# EAGLE design linearIntegrated (EAGLE 8.4.0)
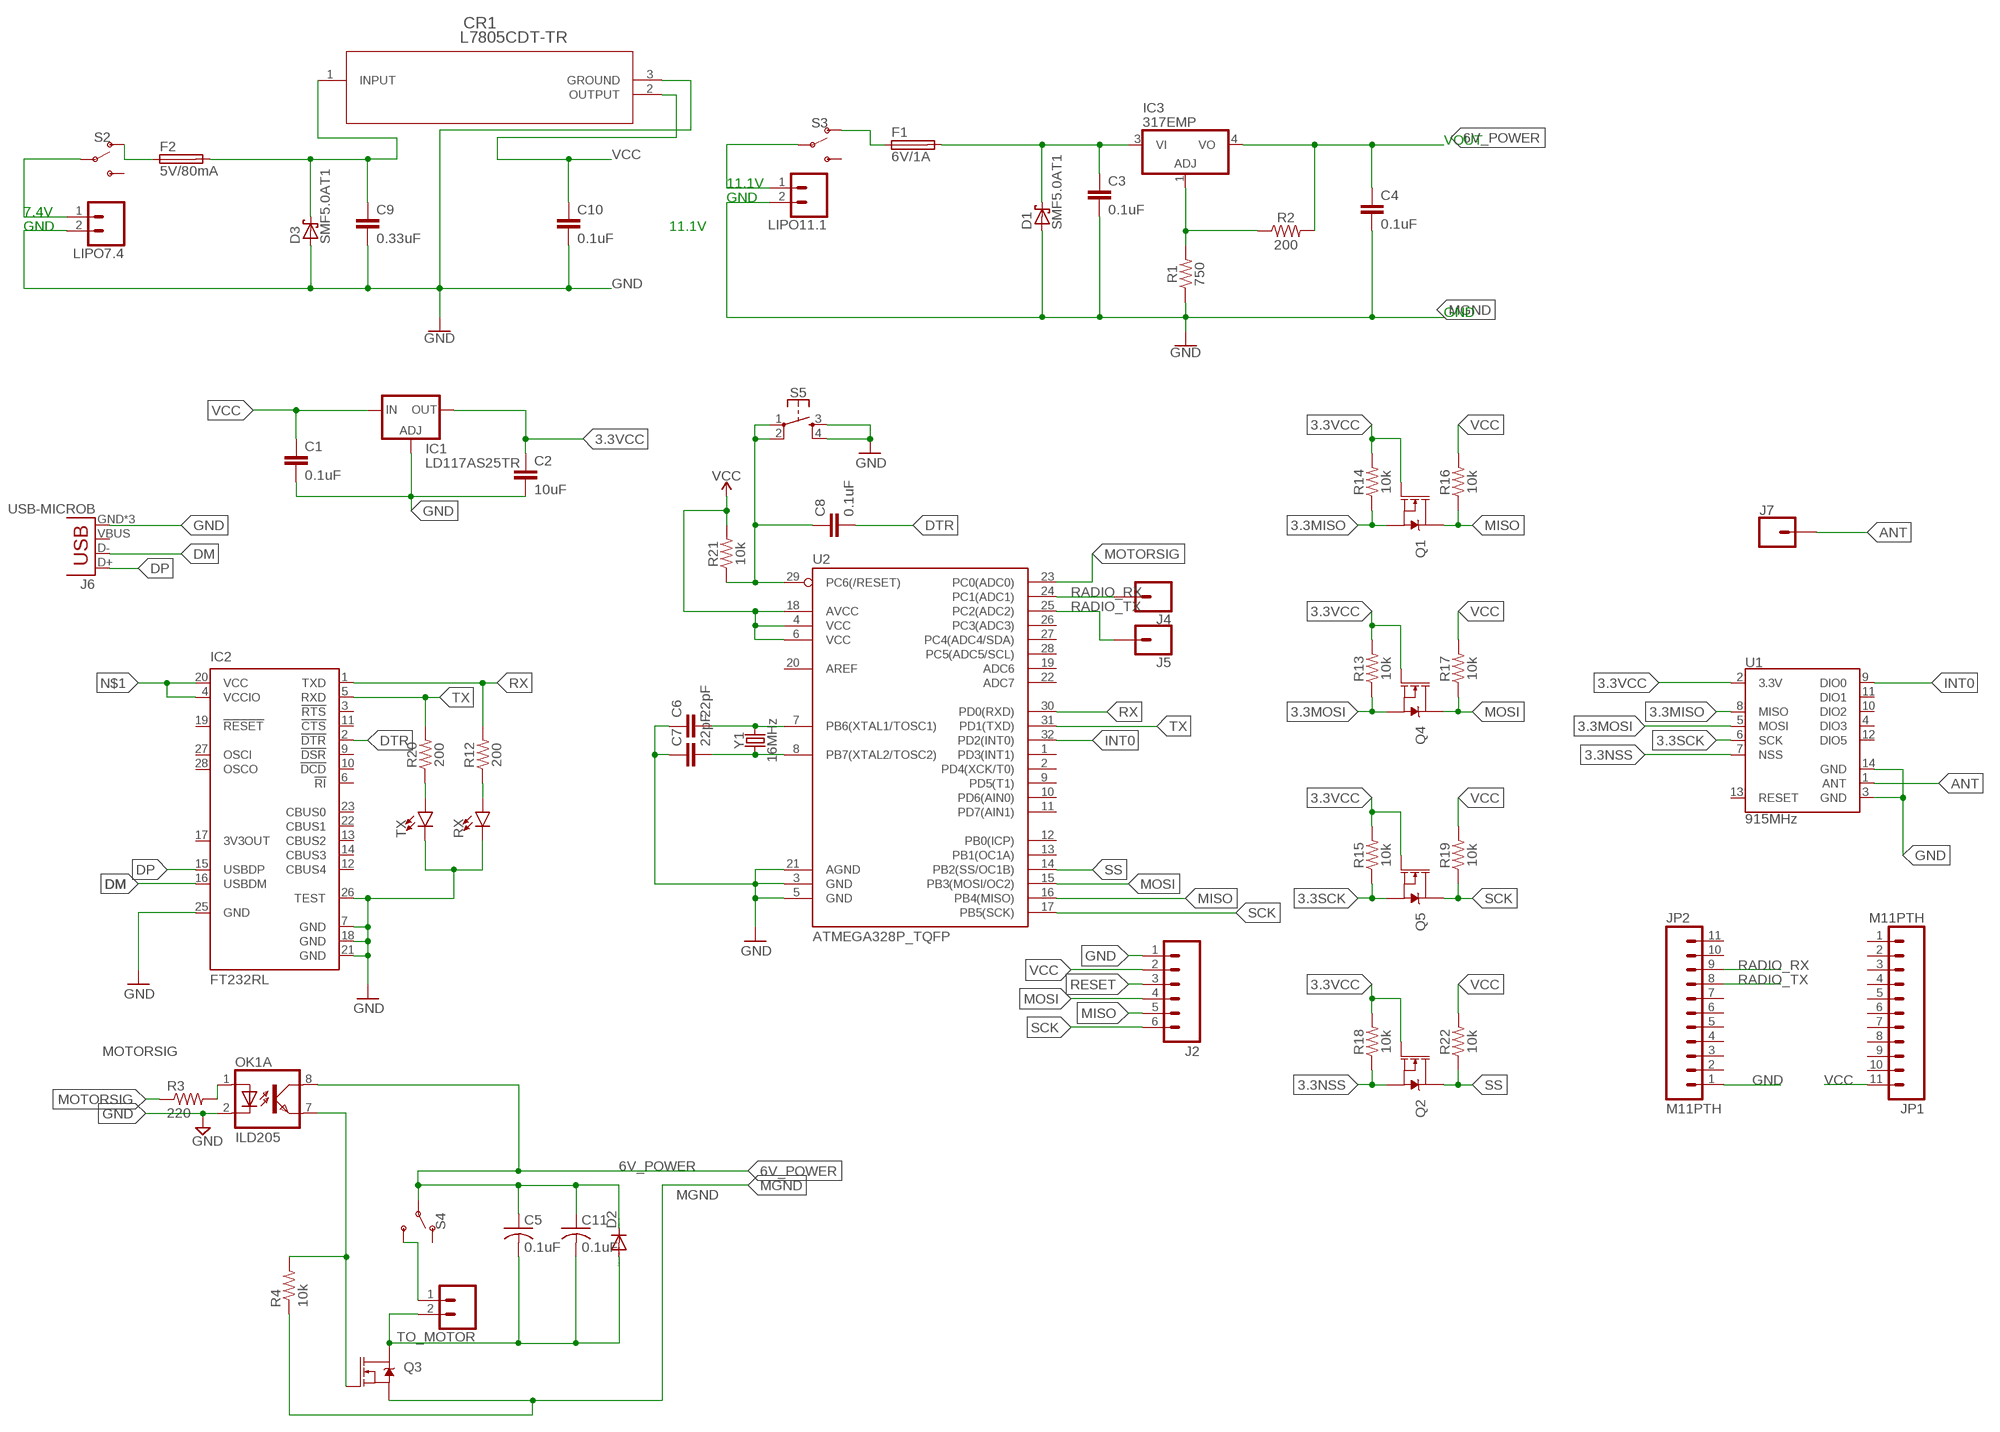
[diagram p0: schematic, sheet 1]

## Parts
C1  0.1uF  10UF-1206-6.3V-20%  [1206]
C2  10uF  10UF-1206-6.3V-20%  [1206]
C3  0.1uF  4.7UF-1206-16V-(+80/-20%)  [1206]
C4  0.1uF  4.7UF-1206-16V-(+80/-20%)  [1206]
C5  0.1uF  C-USC1206  [C1206]
C6  22pF  10UF-1206-6.3V-20%  [1206]
C7  22pF  10UF-1206-6.3V-20%  [1206]
C8  0.1uF  10UF-1206-6.3V-20%  [1206]
C9  0.33uF  4.7UF-1206-16V-(+80/-20%)  [1206]
C10  0.1uF  4.7UF-1206-16V-(+80/-20%)  [1206]
C11  0.1uF  C-USC1206  [C1206]
CR1  L7805CDT-TR  [DPAK]
D1  SMF5.0AT1  [SOD123FL]
D2  DIODE-DO-214AC  [DO-214AC]
D3  SMF5.0AT1  [SOD123FL]
F1  6V/1A  FUSEPICOFUSE  [PICOFUSE]
F2  5V/80mA  FUSEPICOFUSE  [PICOFUSE]
IC1  LD117AS25TR  [SOT223]
IC2  FT232RL  [SSOP28]
IC3  317EMP  [SOT223]
J2  M06FEMALE_LOCK  [1X06_FEMALE_LOCK.010]
J4  CONN_01  [1X01]
J5  CONN_01  [1X01]
J6  USB-MICROB  [USB-MICROB]
J7  CONN_01  [1X01]
JP1  M11PTH  [1X11]
JP2  M11PTH  [1X11]
LIPO7.4  CONN_02  [1X02]
LIPO11.1  CONN_02  [1X02]
OK1  ILD205  [SOIC08]
Q1  220mA/50V/3.5Ω  MOSFET-NCH-BSS138  [SOT23-3]
Q2  220mA/50V/3.5Ω  MOSFET-NCH-BSS138  [SOT23-3]
Q3  MOSFET-NCH-BSS138  [SOT23-3]
Q4  220mA/50V/3.5Ω  MOSFET-NCH-BSS138  [SOT23-3]
Q5  220mA/50V/3.5Ω  MOSFET-NCH-BSS138  [SOT23-3]
R1  750  10OHM-1206-1/4W-1%  [1206]
R2  200  10OHM-1206-1/4W-1%  [1206]
R3  220  RESISTOR1206  [1206]
R4  10k  RESISTOR1206  [1206]
R12  200  RESISTOR1206  [1206]
R13  10k  RESISTOR1206  [1206]
R14  10k  RESISTOR1206  [1206]
R15  10k  RESISTOR1206  [1206]
R16  10k  RESISTOR1206  [1206]
R17  10k  RESISTOR1206  [1206]
R18  10k  RESISTOR1206  [1206]
R19  10k  RESISTOR1206  [1206]
R20  200  RESISTOR1206  [1206]
R21  10k  RESISTOR1206  [1206]
R22  10k  RESISTOR1206  [1206]
RX  LED1206  [LED-1206]
S2  SWITCH-SPDT-PTH-11.6X4.0MM  [SWITCH_SPDT_PTH_11.6X4.0MM]
S3  SWITCH-SPDT-PTH-11.6X4.0MM  [SWITCH_SPDT_PTH_11.6X4.0MM]
S4  SWITCH-SPDT-PTH-11.6X4.0MM  [SWITCH_SPDT_PTH_11.6X4.0MM]
S5  MOMENTARY-SWITCH-SPST-2-SMD-5.2MM  [TACTILE_SWITCH_SMD_5.2MM]
TO_MOTOR  CONN_02  [1X02]
TX  LED1206  [LED-1206]
U1  915MHz  RFM69CW-915MHZ  [RFM69CW-XXXS2]
U2  ATMEGA328P_TQFP  [TQFP32-08]
Y1  16MHz  CRYSTAL-16MHZPTH-HC49US  [HC49US]

## Nets
3.3MISO: Q1.2(S) R14.1 U1.8(MISO)
3.3MOSI: Q4.2(S) R13.1 U1.5(MOSI)
3.3NSS: Q2.2(S) R18.1 U1.7(NSS)
3.3SCK: Q5.2(S) R15.1 U1.6(SCK)
3.3VCC: C2.1 IC1.4(OUT) Q1.1(G) Q2.1(G) Q4.1(G) Q5.1(G) R13.2 R14.2 R15.2 R18.2 U1.2(3.3V)
6V_POWER [motor]: C4.1 C5.1 C11.1 D2.C IC3.4(VO) OK1.8(A:COL) R2.2 S4.2(P)
ANT: J7.1 U1.1(ANT)
DM: IC2.16(USBDM) J6.D-
DP: IC2.15(USBDP) J6.D+
DRAIN [motor]: C5.2 C11.2 D2.A Q3.3(D) TO_MOTOR.2
DTR: C8.2 IC2.2(!DTR)
GATE: OK1.7(A:EMIT) Q3.1(G) R4.2
GND: C1.2 C2.2 C6.1 C7.1 C9.2 C10.2 CR1.3(GROUND) D3.A IC1.1(ADJ) IC2.7(GND) IC2.18(GND) IC2.21(GND) IC2.25(GND) IC2.26(TEST) J2.1 J6.GND J6.MT1(GND) J6.MT2(GND) JP2.1 LIPO7.4.2 OK1.2(A:C) RX.C S5.3 S5.4 TX.C U1.3(GND) U1.14(GND) U2.3(GND) U2.5(GND) U2.21(AGND)
INT0: U1.9(DIO0) U2.32(PD2(INT0))
MGND [motor]: C3.2 C4.2 D1.A LIPO11.1.2 Q3.2(S) R1.1 R4.1 ; supply symbol labelled GND
MISO: J2.5 Q1.3(D) R16.1 U2.16(PB4(MISO))
MOSI: J2.4 Q4.3(D) R17.1 U2.15(PB3(MOSI/OC2))
MOTORSIG: R3.1 U2.23(PC0(ADC0))
N$1: IC2.4(VCCIO) IC2.20(VCC)
N$4: C6.2 U2.7(PB6(XTAL1/TOSC1)) Y1.2
N$5: C7.2 U2.8(PB7(XTAL2/TOSC2)) Y1.1
N$6 [motor]: F1.1 S3.1(O)
N$7: R20.1 TX.A
N$8: R12.1 RX.A
N$9 [motor]: C3.1 D1.C F1.2 IC3.3(VI)
N$10 [motor]: IC3.1(ADJ) R1.2 R2.1
N$11 [motor]: LIPO11.1.1 S3.2(P)
N$12: OK1.1(A:A) R3.2
N$13 [motor]: S4.3(S) TO_MOTOR.1
N$19: LIPO7.4.1 S2.2(P)
N$20: F2.1 S2.1(O)
N$21: C9.1 CR1.1(INPUT) D3.C F2.2
RADIO_RX: J4.1 JP2.9 U2.24(PC1(ADC1))
RADIO_TX: J5.1 JP2.8 U2.25(PC2(ADC2))
RESET: C8.1 J2.3 R21.1 S5.1 S5.2 U2.29(PC6(/RESET))
RX: IC2.1(TXD) R12.2 U2.30(PD0(RXD))
SCK: J2.6 Q5.3(D) R19.1 U2.17(PB5(SCK))
SS: Q2.3(D) R22.1 U2.14(PB2(SS/OC1B))
TX: IC2.5(RXD) R20.2 U2.31(PD1(TXD))
VCC: C1.1 C10.1 CR1.2(OUTPUT) IC1.3(IN) J2.2 JP1.11 R16.2 R17.2 R19.2 R21.2 R22.2 U2.4(VCC) U2.6(VCC) U2.18(AVCC)
Unconnected: IC2.3(!RTS) IC2.6(!RI) IC2.9(!DSR) IC2.10(!DCD) IC2.11(!CTS) IC2.12(CBUS4) IC2.13(CBUS2) IC2.14(CBUS3) IC2.17(3V3OUT) IC2.19(!RESET) IC2.22(CBUS1) IC2.23(CBUS0) IC2.27(OSCI) IC2.28(OSCO) J6.VBUS JP1.1 JP1.2 JP1.3 JP1.4 JP1.5 JP1.6 JP1.7 JP1.8 JP1.9 JP1.10 JP2.2 JP2.3 JP2.4 JP2.5 JP2.6 JP2.7 JP2.10 JP2.11 OK1.3(B:A) OK1.4(B:C) OK1.5(B:EMIT) OK1.6(B:COL) S2.3(S) S3.3(S) S4.1(O) U1.4(DIO3) U1.10(DIO2) U1.11(DIO1) U1.12(DIO5) U1.13(RESET) U2.1(PD3(INT1)) U2.2(PD4(XCK/T0)) U2.9(PD5(T1)) U2.10(PD6(AIN0)) U2.11(PD7(AIN1)) U2.12(PB0(ICP)) U2.13(PB1(OC1A)) U2.19(ADC6) U2.20(AREF) U2.22(ADC7) U2.26(PC3(ADC3)) U2.27(PC4(ADC4/SDA)) U2.28(PC5(ADC5/SCL))

## Notes on the sheet
- VOUT
- 11.1V
- GND
- 7.4V
- GND | 11.1V
- GND

## Library data of the parts
C1 C6-C8 = SparkFun-Capacitors:10UF: 10.0µF ceramic capacitors A capacitor is a passive two-terminal electrical component used to store electrical energy temporarily in an electric field.; PROD_ID: CAP-10057; VALUE: 10uF
C2 = SparkFun-Capacitors:10UF: 10.0µF ceramic capacitors A capacitor is a passive two-terminal electrical component used to store electrical energy temporarily in an electric field.; PROD_ID: CAP-10057
C3 C4 C9 C10 = SparkFun-Capacitors:4.7UF: 4.7µF ceramic capacitors A capacitor is a passive two-terminal electrical component used to store electrical energy temporarily in an electric field.; PROD_ID: CAP-10300; VALUE: 4.7uF
C5 C11 = rcl:C-US: CAPACITOR, American symbol
CR1 = 7805:L7805CDT-TR; MANUFACTURER_PART_NUMBER: L7805CDTTR; VENDOR: ST Microelectronics
D1 D3 = diode:SMF5.0AT1: 200 W Transient Voltage Suppressor Source: Data sheet <http://www.onsemi.com/pub_link/Collateral/SMF5.0AT1-D.PDF>
D2 = diode:DIODE-: DIODE
F1 F2 = fuse:FUSE: Fuse; OC_FARNELL: unknown; OC_NEWARK: unknown
IC1 = v-reg:LD117A?*: Low drop fixed and adjustable positive voltage regulators 1 A Source: http://www.st.com/stonline/products/literature/ds/7194/ld1117axx.pdf
IC2 = ftdichip:FT232R: Source: http://www.ftdichip.com/Documents/DataSheets/DS_FT232R_v104.pdf; MPN: FT232RL; OC_FARNELL: 1146032; OC_NEWARK: 91K9918
IC3 = linear:*317: Positive VOLTAGE REGULATOR
J2 = SparkFun-Connectors:M06: Header 6 Standard 6-pin 0.1" header. Use with straight break away headers (SKU : PRT-00116), right angle break away headers (PRT-00553), swiss pins (PRT-00743), machine pins (PRT-00117), and female headers (PRT-00115). Molex polarized connector foot print use with SKU : PRT-08094 with associated crimp pins and housings. NOTES ON THE VARIANTS LOCK and LOCK_LONGPADS... This footprint was designed to help hold the alignment of a through-hole component (i.e. 6-pin header) while soldering it into place. You may notice that each hole has been shifted either up or down by 0.005 of an inch from it's more standard position (which is a perfectly straight line). This slight alteration caused the pins (the squares in the middle) to touch the edges of the holes. Because they are alternating, it causes a "brace" to hold the component in place. 0.005 has proven to be the perfect amount of "off-center" position when using our standard breakaway headers. Although looks a little odd when you look at the bare footprint, once you have a header in there, the alteration is very hard to notice. Also,if you push a header all the way into place, it is covered up entirely on the bottom side. This idea of altering the position of holes to aid alignment will be further integrated into the Sparkfun Library for other footprints. It can help hold any component with 3 or more connection pins.
J4 J5 J7 = SparkFun-Connectors:CONN_01: Single connection point. Often used as Generic Header-pin footprint for 0.1 inch spaced/style header connections On any of the 0.1 inch spaced packages, you can populate with these: Break Away Headers - Straight <https://www.sparkfun.com/products/116> (PRT-00116) Break Away Male Headers - Right Angle <https://www.sparkfun.com/products/553> (PRT-00553) Female Headers <https://www.sparkfun.com/products/115> (PRT-00115) Break Away Headers - Machine Pin <https://www.sparkfun.com/products/117> (PRT-00117) Break Away Female Headers - Swiss Machine Pin <https://www.sparkfun.com/products/743> (PRT-00743) This device is also useful as a general connection point to wire up your design to another part of your project. Our various solder wires solder well into these plated through hole pads. Hook-Up Wire - Assortment (Stranded, 22 AWG) <https://www.sparkfun.com/products/11375> (PRT-11375) Hook-Up Wire - Assortment (Solid Core, 22 AWG) <https://www.sparkfun.com/products/11367> (PRT-11367) View the entire wire category on our website here <https://www.sparkfun.com/categories/141> Special notes: SMTSO-256-ET is a "flush mount" nut for a 4-40 screw. We mostly use this on specialty testbeds; it is a nice way to connect hardware to your PCB at an adjustable hieght. Also note, the SNAP packages are for using a snappable style connector. We sell a baggie of snaps and they are also used on two LilyPad designs: Snap Assortment - 30 pack (male and female) <https://www.sparkfun.com/products/11347> (DEV-11347) LilyPad Arduino SimpleSnap <https://www.sparkfun.com/products/10941> (DEV-10941) LilyPad SimpleSnap Protoboard <https://www.sparkfun.com/products/10940> (DEV-10940)
J6 = SparkFun-Retired:USB: USB Connectors USB-B-PTH is fully proven SKU : PRT-00139/CONN-08278 USB-miniB is fully proven SKU : PRT-00587 USB-A-PCB is untested. USB-A-H is throughly reviewed, but untested. Spark Fun Electronics SKU : PRT-00437 USB-B-SMT is throughly reviewed, but untested. Needs silkscreen touching up. USB-A-S has not been used/tested USB-MB-H has not been used/tested USB-MICROB has been used. CONN-09505; PROD_ID: CONN-09505
JP1 JP2 = SparkFun:M11: Header 11 Standard 11-pin 0.1" header. Use with straight break away headers (SKU : PRT-00116), right angle break away headers (PRT-00553), swiss pins (PRT-00743), machine pins (PRT-00117), and female headers (PRT-00115).
LIPO7.4 LIPO11.1 TO_MOTOR = SparkFun-Connectors:CONN_02: Multi connection point. Often used as Generic Header-pin footprint for 0.1 inch spaced/style header connections On any of the 0.1 inch spaced packages, you can populate with these: Break Away Headers - Straight <https://www.sparkfun.com/products/116> (PRT-00116) Break Away Male Headers - Right Angle <https://www.sparkfun.com/products/553> (PRT-00553) Female Headers <https://www.sparkfun.com/products/115> (PRT-00115) Break Away Headers - Machine Pin <https://www.sparkfun.com/products/117> (PRT-00117) Break Away Female Headers - Swiss Machine Pin <https://www.sparkfun.com/products/743> (PRT-00743) For SCREWTERMINALS and SPRING TERMINALS visit here: Screw Terimnals on SparkFun.com <https://www.sparkfun.com/search/results?term=Screw+Terminals> (5mm/3.5mm/2.54mm spacing) This device is also useful as a general connection point to wire up your design to another part of your project. Our various solder wires solder well into these plated through hole pads. Hook-Up Wire - Assortment (Stranded, 22 AWG) <https://www.sparkfun.com/products/11375> (PRT-11375) Hook-Up Wire - Assortment (Solid Core, 22 AWG) <https://www.sparkfun.com/products/11367> (PRT-11367) View the entire wire category on our website here <https://www.sparkfun.com/categories/141> Special notes: Molex polarized connector foot print use with: PRT-08233 with associated crimp pins and housings. 2.54_SCREWTERM for use with PRT-10571. 3.5mm Screw Terminal footprints for PRT-08084 5mm Screw Terminal footprints for use with PRT-08432
OK1 = optocoupler:ILD2*: Siemens ILD205/206/207/211/213/217 DUAL PHOTOTRANSISTOR SMALL OUTLINE SURFACE MOUNT OPTOCOUPLER Source: 153385-da-01-en-Optocoupler_ILD205-T.pdf; MF: VISHAY/TELEFUNKEN; MPN: ILD205T; OC_FARNELL: 1469512; OC_NEWARK: 20H8678
Q1 Q2 Q4 Q5 = SparkFun-DiscreteSemi:MOSFET-NCH: N-channel MOSFETs Voltage controlled devices that allow control of high current outputs. SparkFun Products: SparkFun OpenScale <https://www.sparkfun.com/products/13261> SparkFun Digital Sandbox <https://www.sparkfun.com/products/12651> SparkFun Monster Moto Shield <https://www.sparkfun.com/products/10182> SparkFun MOSFET Power Controller <https://www.sparkfun.com/products/11214>; PROD_ID: TRANS-00830
Q3 = SparkFun-DiscreteSemi:MOSFET-NCH: N-channel MOSFETs Voltage controlled devices that allow control of high current outputs. SparkFun Products: SparkFun OpenScale <https://www.sparkfun.com/products/13261> SparkFun Digital Sandbox <https://www.sparkfun.com/products/12651> SparkFun Monster Moto Shield <https://www.sparkfun.com/products/10182> SparkFun MOSFET Power Controller <https://www.sparkfun.com/products/11214>; PROD_ID: TRANS-00830; VALUE: 220mA/50V/3.5Ω
R1 R2 = SparkFun-Resistors:10OHM: 10Ω resistor A resistor is a passive two-terminal electrical component that implements electrical resistance as a circuit element. Resistors act to reduce current flow, and, at the same time, act to lower voltage levels within circuits. - Wikipedia; PROD_ID: RES-08705; VALUE: 10
R3 R4 = SparkFun-Passives:RESISTOR: Resistor Basic schematic elements and footprints for 0603, 1206, and PTH resistors.
R12-R22 = SparkFun-Resistors:RESISTOR: Generic Resistor Package
RX TX = SparkFun-LED:LED: LED (Generic) Standard schematic elements and footprints for 5mm, 3mm, 1206, and 0603 sized LEDs. Generic LEDs with no color specified.
S2-S4 = SparkFun-Switches:SWITCH-SPDT: Single Pole, Double Throw (SPDT) Switch Single-pole, double-throw (SPDT) switch. Variant Overview SMD-AYZ0202 Surface Mount DPDT Switch <https://www.sparkfun.com/products/597> (COM-00597) Used on e.g. LilyPad Arduino USB - ATmega32U4 Board <https://www.sparkfun.com/products/12049> PTH-11.6X4.0MM SPDT Mini Power Switch <https://www.sparkfun.com/products/102> (COM-00102) Used on e.g. SparkFun Simon Says - Through-Hole Soldering Kit <https://www.sparkfun.com/products/10547> (KIT-10547) PTH-11.6X4.0MM-KIT KIT version of SPDT Mini Power Switch - Simplifies soldering by removing tStop of switch pins - only one side can be soldered. PTH-11.6X4.0MM-LOCK LOCK version of SPDT Mini Power Switch - Offset pins hold switch in place for easier soldering. SMD-RIGHT-ANGLE Surface Mount Right Angle Switch <https://www.sparkfun.com/products/10860> (COM-10860) Used on e.g. SparkFun ESP8266 Thing <https://www.sparkfun.com/products/13231>; PROD_ID: SWCH-08261; SF_SKU: COM-00102
S5 = SparkFun-Switches:MOMENTARY-SWITCH-SPST-2: Momentary Switch (Pushbutton) - SPST - Two Circuits Normally-open (NO) SPST momentary switches (buttons, pushbuttons). Schematic symbol includes two switch circuits. Variants SMD-4.6MMX2.8MM - 4.60mm x 2.80mm Tactile Momentary Button Switch - Used on SparkFun SAMD21 Mini Breakout <https://www.sparkfun.com/products/13664> SMD-5.2MM - Mini Pushbutton Switch - SMD <https://www.sparkfun.com/products/8720> - Used on Arduino Pro Mini <https://www.sparkfun.com/products/11114>; PROD_ID: SWCH-08247; SF_SKU: COM-08720
U1 = SparkFun-RF:RFM69: Hope RF RFM69CW ISM Transceiver Module The RFM69CW radio module by HopeRF is a compact, powerful radio transceiver module for swapping data packets in the 868 MHz ISM band, using standard and enhanced FSK modulation. The radio is great for sub-compact designs; just 4mm of mounted height from using an SMD precision crystal. Datasheet <http://www.hoperf.com/upload/rf/RFM69CW-V1.1.pdf>; PROD_ID: IC-11996
U2 = SparkFun-IC-Microcontroller:ATMEGA328P_TQFP: Popular 328P in QFP Storefront component: ATmega328 - TQFP <https://www.sparkfun.com/products/13448> (COM-13448) Datasheet <http://www.sparkfun.com/datasheets/Components/SMD/ATMega328.pdf> SparkFun Products SparkFun RedBoard - Programmed with Arduino <https://www.sparkfun.com/products/12757> (DEV-12757) Arduino Pro Mini 328 - 5V/16MHz <https://www.sparkfun.com/products/11113> (DEV-11113) Arduino Pro Mini 328 - 3.3V/8MHz <https://www.sparkfun.com/products/11114> (DEV-11114) SparkFun OpenLog <https://www.sparkfun.com/products/13712> (DEV-13712) SparkFun MicroView - OLED Arduino Module <https://www.sparkfun.com/products/12923> (DEV-12923) SparkFun Digital Sandbox <https://www.sparkfun.com/products/12651> (DEV-12651) SparkFun PicoBoard <https://www.sparkfun.com/products/11888> (WIG-11888) Arduino Fio <https://www.sparkfun.com/products/10116> (DEV-10116) LilyPad Arduino 328 Main Board <https://www.sparkfun.com/products/13342> (DEV-13342) SparkFun RedStick <https://www.sparkfun.com/products/13741> (DEV-13741) LilyPad MP3 <https://www.sparkfun.com/products/11013> (DEV-11013) LilyPad Arduino SimpleSnap <https://www.sparkfun.com/products/10941> (DEV-10941) SparkFun Stepoko <https://www.sparkfun.com/products/13899> (ROB-13899) SparkFun Geiger Counter <https://www.sparkfun.com/products/11345> (SEN-11345) SparkFun EL Sequencer <https://www.sparkfun.com/products/12781> (COM-12781) Arduino Pro 328 - 5V/16MHz <https://www.sparkfun.com/products/10915> (DEV-10915) CryptoCape <https://www.sparkfun.com/products/12773> (DEV-12773) SparkFun IR Thermometer Evaluation Board - MLX90614 <https://www.sparkfun.com/products/10740> (SEN-10740) SparkFun RedBot Mainboard <https://www.sparkfun.com/products/12097> (ROB-12097) Arduino Pro 328 - 3.3V/8MHz <https://www.sparkfun.com/products/10914> (DEV-10914) SparkFun Block for Intel® Edison - Arduino <https://www.sparkfun.com/products/13036> (DEV-13036) SparkFun Simon Says - Surface Mount Soldering Kit <https://www.sparkfun.com/products/10935> (KIT-10935) SparkFun 7-Segment Serial Display - Red <https://www.sparkfun.com/products/11441> (COM-11441) SparkFun 7-Segment Serial Display - White <https://www.sparkfun.com/products/11629> (COM-11629) SparkFun 7-Segment Serial Display - Yellow <https://www.sparkfun.com/products/11443> (COM-11443) SparkFun 7-Segment Serial Display - Kelly Green <https://www.sparkfun.com/products/11440> (COM-11440) SparkFun 7-Segment Serial Display - Blue <https://www.sparkfun.com/products/11442> (COM-11442) SparkFun OpenSegment Serial Display - 20mm (Blue) <https://www.sparkfun.com/products/11647> (COM-11647) SparkFun OpenSegment Serial Display - 20mm (Green) <https://www.sparkfun.com/products/11646> (COM-11646) SparkFun OpenSegment Serial Display - 20mm (White) <https://www.sparkfun.com/products/11648> (COM-11648) SparkFun OpenSegment Serial Display - 20mm (Red) <https://www.sparkfun.com/products/11644> (COM-11644) SparkFun OpenSegment Serial Display - 20mm (Yellow) <https://www.sparkfun.com/products/11645> (COM-11645) SparkFun OpenSegment Shield <https://www.sparkfun.com/products/13190> (DEV-13190); PROD_ID: IC-09069
Y1 = SparkFun-Clocks:CRYSTAL-16MHZ: 16MHz Crystal Digikey Example <http://www.digikey.com/product-search/en?keywords=535-9122-1-ND> Frequency: 16MHz Frequency Stability: ±50ppm Frequency Tolerance: ±20ppm Load Capacitance: 18pF SparkFun Products: Pro Micro -5V/16MHz <https://www.sparkfun.com/products/12640> SparkFun Serial Enabled LCD Kit <https://www.sparkfun.com/products/10097>; PROD_ID: XTAL-08181; SF_ID: COM-00536

## Net classes
1 motor: width 0.61 mm

## Board
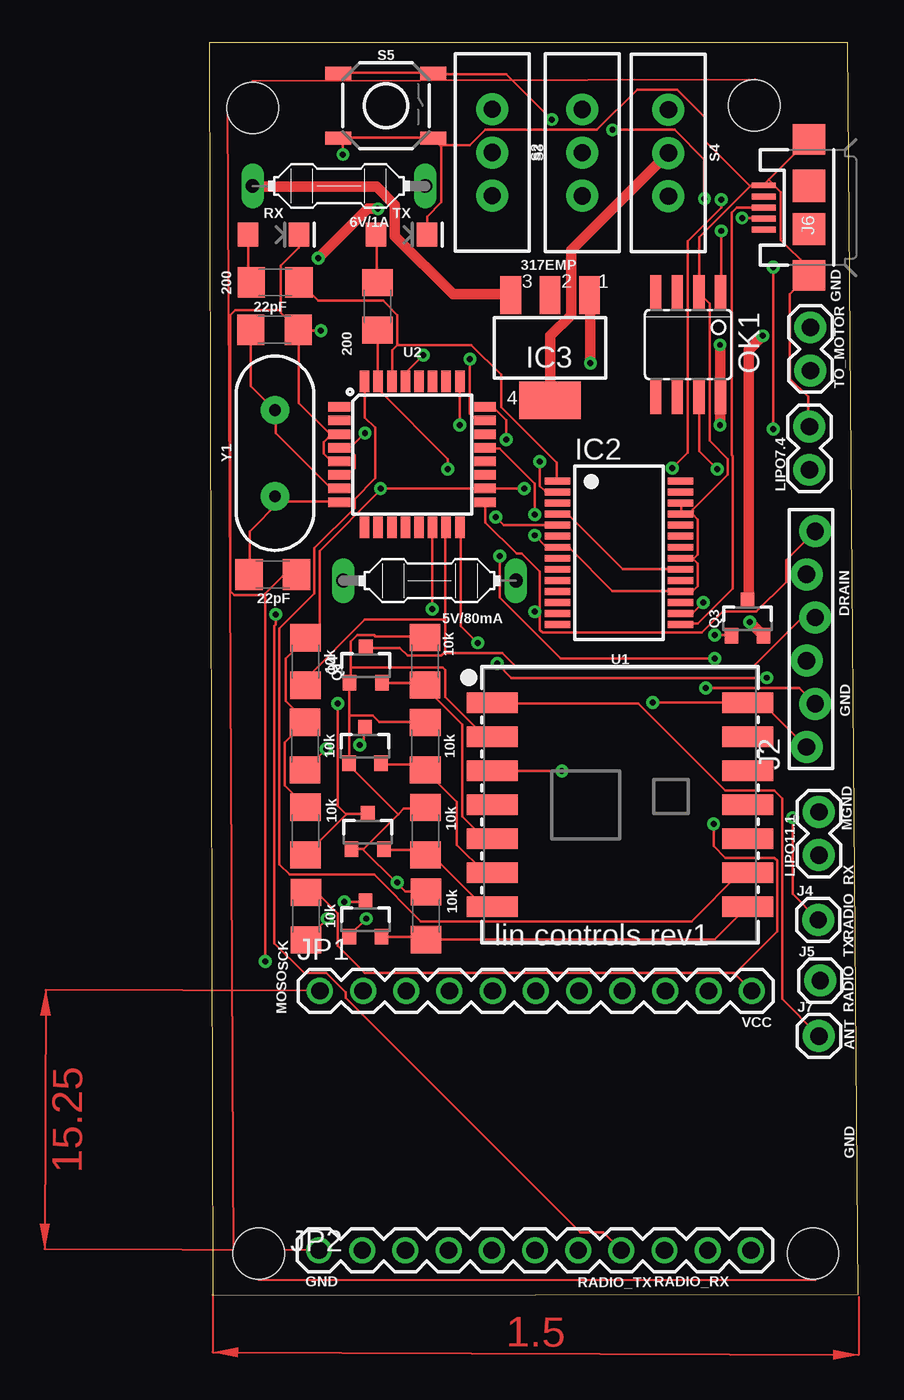
[diagram p1: board, top side]
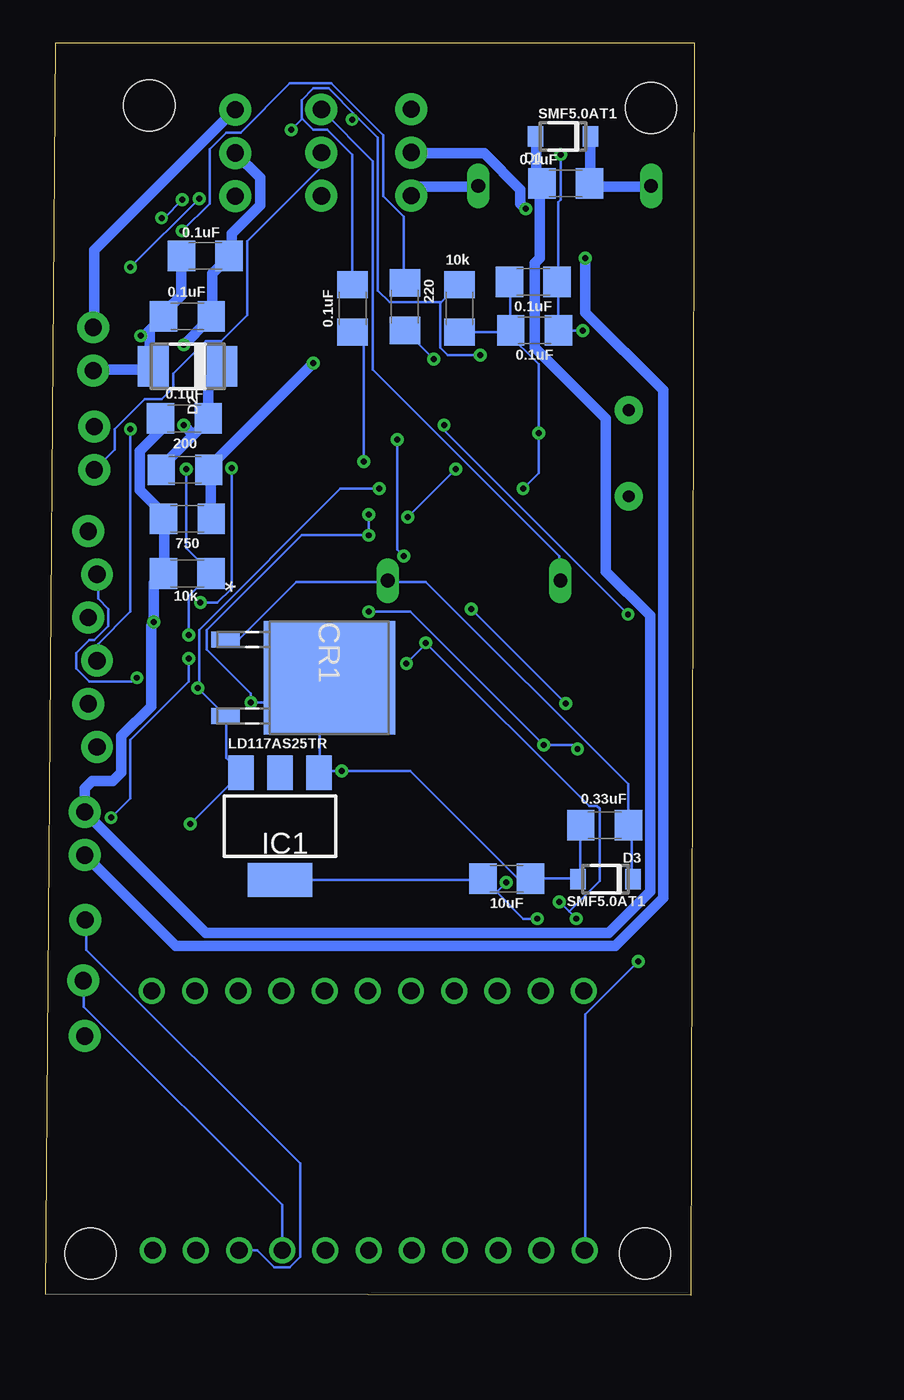
[diagram p2: board, bottom side, seen from below]

Size 38.15 x 73.7 mm. Coordinates in mm from the lower left corner, seen from the top.
Outline: 0.2,0 38.15,0.05 37.55,73.7 0,73.7 0.2,0
Copper layers (1*16): Top 0.035mm / dielectric 1.5mm / Bottom 0.035mm
Design rules "default": minimum track width 6mil, minimum drill 0.35mm, track to track 6mil, track to pad 6mil, pad to pad 6mil, via to via 6mil, smd to smd 6mil, copper to edge 40mil, drill to drill 6mil, minimum pad ring 10mil, minimum via ring 8mil, stop-mask expansion 4mil, vias tented up to drill 0mil, thermal gap 10mil
Holes 3 mm at 35.5,2.45 2.9,2.45 2.55,69.85 32.05,70

### Footprints (pad centres in the part's own frame; a part is rotated, then mirrored left to right if it is on the bottom)
1206 = smd 1.6 x 1.8: 1 -1.4,0; 2 1.4,0
C1206 = smd 1.6 x 1.8: 1 -1.4,0; 2 1.4,0
DPAK = smd 0.94 x 1.702: 1 -2.25,-6.109; 2 2.25,-6.109 | smd 6.655 x 7.722: 3 0,0
SOD123FL = smd 0.91 x 1.22: A 1.625,0; C -1.625,0
DO-214AC = smd 1.8 x 2.4: A 2.025,0; C -2.025,0
PICOFUSE = drill 0.813 long: 1 -5.08,0; 2 5.08,0
SOT223 = smd 1.5 x 2: 1 -2.3,-3.15; 2 0,-3.15; 3 2.3,-3.15 | smd 3.8 x 2: 4 0,3.15
SSOP28 = smd 0.4 x 1.5: 1 -4.225,-3.625; 2 -3.575,-3.625; 3 -2.925,-3.625; 4 -2.275,-3.625; 5 -1.625,-3.625; 6 -0.975,-3.625; 7 -0.325,-3.625; 8 0.325,-3.625; 9 0.975,-3.625; 10 1.625,-3.625; 11 2.275,-3.625; 12 2.925,-3.625; 13 3.575,-3.625; 14 4.225,-3.625; 15 4.225,3.625; 16 3.575,3.625; 17 2.925,3.625; 18 2.275,3.625; 19 1.625,3.625; 20 0.975,3.625; 21 0.325,3.625; 22 -0.325,3.625; 23 -0.975,3.625; 24 -1.625,3.625; 25 -2.275,3.625; 26 -2.925,3.625; 27 -3.575,3.625; 28 -4.225,3.625
SOT223' = smd 1.219 x 2.235: 1 -2.311,-3.099; 2 0,-3.099; 3 2.311,-3.099 | smd 3.6 x 2.2: 4 0,3.099
1X06_FEMALE_LOCK.010 = drill 1.016 pad 1.88: 1 0,0.254; 2 2.54,-0.254; 3 5.08,0.254; 4 7.62,-0.254; 5 10.16,0.254; 6 12.7,-0.254
1X01 = drill 1.016 pad 1.88: 1 0,0
USB-MICROB = smd 0.35 x 1.4: D+ 0,2.65; D- -0.65,2.65; GND 1.3,2.65; ID 0.65,2.65; VBUS -1.3,2.65 | smd 1.8 x 1.9: MT1 -4,0; MT2 4,0 | smd 1.9 x 1.9: P$1 -1.27,0; P$2 1.27,0
1X11 = drill 1.016: 1 0,0; 2 2.54,0; 3 5.08,0; 4 7.62,0; 5 10.16,0; 6 12.7,0; 7 15.24,0; 8 17.78,0; 9 20.32,0; 10 22.86,0; 11 25.4,0
1X02 = drill 1.016 pad 1.88: 1 0,0; 2 2.54,0
SOIC08 = smd 0.66 x 2.032: 1 -1.905,-3.073; 2 -0.635,-3.073; 3 0.635,-3.073; 4 1.905,-3.073; 5 1.905,3.073; 6 0.635,3.073; 7 -0.635,3.073; 8 -1.905,3.073
SOT23-3 = smd 0.8 x 0.9: 1 -0.95,-1; 2 0.95,-1; 3 0,1.1
LED-1206 = smd 1.2 x 1.4: A -1.5,0; C 1.5,0
SWITCH_SPDT_PTH_11.6X4.0MM = drill 1.016 pad 1.88: 1 0,2.54; 2 0,0; 3 0,-2.54
TACTILE_SWITCH_SMD_5.2MM = smd 1.524 x 0.762: 1 -2.794,1.905; 2 2.794,1.905; 3 -2.794,-1.905; 4 2.794,-1.905
RFM69CW-XXXS2 = smd 3 x 1.2: 1 -7.5,6; 2 -7.5,4; 3 -7.5,2; 4 -7.5,0; 5 -7.5,-2; 6 -7.5,-4; 7 -7.5,-6; 8 7.5,-6; 9 7.5,-4; 10 7.5,-2; 11 7.5,0; 12 7.5,2; 13 7.5,4; 14 7.5,6
TQFP32-08 = smd 1.27 x 0.559: 1 -4.293,2.8; 2 -4.293,2; 3 -4.293,1.2; 4 -4.293,0.4; 5 -4.293,-0.4; 6 -4.293,-1.2; 7 -4.293,-2; 8 -4.293,-2.8; 17 4.293,-2.8; 18 4.293,-2; 19 4.293,-1.2; 20 4.293,-0.4; 21 4.293,0.4; 22 4.293,1.2; 23 4.293,2; 24 4.293,2.8 | smd 0.559 x 1.27: 9 -2.8,-4.293; 10 -2,-4.293; 11 -1.2,-4.293; 12 -0.4,-4.293; 13 0.4,-4.293; 14 1.2,-4.293; 15 2,-4.293; 16 2.8,-4.293; 25 2.8,4.293; 26 2,4.293; 27 1.2,4.293; 28 0.4,4.293; 29 -0.4,4.293; 30 -1.2,4.293; 31 -2,4.293; 32 -2.8,4.293
HC49US = drill 0.7 pad 1.651: 1 -2.54,0; 2 2.54,0

### Placement (x,y rotation side)
C1  9.47,59.62 0 bottom
C2  11.03,24.51 0 bottom
C3  7.56,65.41 180 bottom
C4  29.99,51.58 180 bottom
C5  29.81,57.59 180 bottom
C6  3.83,56.8 180 top
C7  3.73,42.4 180 top
C8  20.09,58.06 270 bottom
C9  5.27,27.65 180 bottom
C10  9.39,56.77 0 bottom
C11  28.76,61.14 180 bottom
CR1  21.46,36.33 270 bottom
D1  7.72,68.17 180 bottom
D2  29.79,54.65 180 bottom
D3  5.22,24.48 180 bottom
F1  7.62,65.26 180 top
F2  12.95,42.04 0 top
IC1  24.37,27.59 180 bottom
IC2  24.09,43.68 270 top
IC3  317EMP  [SOT223']  20.04,55.74 180 top
J2  35.38,32.25 90 top
J4  35.81,22.08 0 top
J5  35.93,18.51 0 top
J6  35.26,63.99 90 top
J7  35.85,15.25 0 top
JP1  6.5,17.9 0 top
JP2  6.45,2.65 0 top
LIPO7.4  35.29,48.56 90 top
LIPO11.1  35.85,25.89 90 top
OK1  28.16,55.93 180 top
Q1  9.18,22.09 0 top
Q2  9.32,27.24 0 top
Q3  31.65,39.8 0 top
Q4  9.2,37.04 0 top
Q5  9.15,32.29 0 top
R1  29.81,45.68 0 bottom
R2  29.95,48.56 180 bottom
R3  17.02,58.16 90 bottom
R4  29.82,42.46 0 bottom
R12  3.87,59.59 0 top
R13  12.68,37.3 90 top
R14  12.74,22.32 90 top
R15  12.7,32.3 90 top
R16  5.68,22.3 90 top
R17  5.66,37.28 90 top
R18  12.72,27.29 90 top
R19  5.63,32.31 90 top
R20  9.89,58.18 270 top
R21  13.81,58.06 270 bottom
R22  5.65,27.31 90 top
RX  3.77,62.4 0 top
S2  21.93,67.22 0 top
S3  16.64,67.23 180 top
S4  27,67.2 180 top
S5  10.38,69.98 0 top
TO_MOTOR  35.35,56.94 270 top
TX  11.29,62.4 0 top
U1  24.15,28.85 0 top
U2  11.93,49.46 0 top
Y1  3.86,49.54 90 top

### Tracks (layer width: path | path; a pad name or v marks a point on that pad's centre or on a via)
3.3MISO
  Top 0.152: Q1.2 10.14,21.09 12.51,21.09 12.66,20.93 R14.1 12.81,20.93 29.73,20.93 31.63,22.84 U1.8
3.3MOSI
  Top 0.152: Q4.2 10.22,36.02 12.58,36.02 12.66,35.94 R13.1 12.74,35.87 12.74,35.72 14.87,33.58 14.87,28.17 16.17,26.88 16.62,26.88 U1.5
3.3NSS
  Top 0.152: Q2.2 10.3,26.19 12.43,26.19 12.66,25.96 R18.1 12.74,25.89 13.12,25.89 16.09,22.92 16.62,22.92 U1.7
3.3SCK
  Top 0.152: Q5.2 10.14,31.22 12.36,31.22 12.66,30.92 R15.1 12.74,30.84 14.56,29.01 14.56,26.5 16.17,24.9 16.62,24.9 U1.6
3.3VCC  (via drill 0.35)
  Top 0.152: v9.23,22.15 8.24,21.16 Q1.1 | 9,26.27 9.08,26.27 11.1,28.29 | 9,26.27 8.39,26.27 Q2.1 | 11.1,28.29 11.44,28.63 12.66,28.63 R18.2 | 9,26.27 11.02,24.25 | 11.02,24.25 11.52,23.75 12.66,23.75 R14.2 | 8.24,34.12 8.24,36.02 Q4.1 8.32,36.1 8.32,36.94 | 8.24,34.12 8.24,31.3 Q5.1 8.16,31.22 11.1,28.29 | 8.24,34.12 9.61,34.12 9.99,33.73 12.66,33.73 R15.2 | 8.32,36.94 8.32,38.46 8.7,38.84 9.69,38.84 9.76,38.76 12.66,38.76 R13.2 | 8.32,36.94 13.73,36.94 13.88,36.78 13.88,35.18 16.17,32.9 16.62,32.9 U1.2 | v11.06,24.29 11.02,24.25
  Bottom 0.152: v9.23,22.15 10.07,22.15 11.63,23.71 | 11.63,23.71 12.36,24.44 C2.1 12.43,24.44 24.32,24.44 IC1.4 | v11.06,24.29 11.63,23.71
6V_POWER  (via drill 0.35)
  Top 0.61: v30.03,51.19 30.03,52.78 OK1.8 30.03,53.17 v30.03,55.91 | IC3.4 20.05,52.71 20.05,56.44 21.27,57.66 21.27,61.47 26.99,67.19 S4.2
  Bottom 0.61: D2.C 27.82,54.61 28.58,53.85 28.58,51.64 C4.1 28.74,51.34 29.46,50.61 | 29.46,50.61 31.33,48.75 31.33,48.59 R2.2 | 29.46,50.61 v30.03,51.19 | S4.2 26.99,67.19 25.54,65.74 25.54,64.14 27.21,62.46 27.21,61.4 C11.1 27.37,61.09 28.36,60.1 28.36,57.66 C5.1 28.58,57.36 v30.03,55.91
ANT
  Top 0.152: U1.1 16.7,34.8 25.23,34.8 30.34,29.7 33.23,29.7 33.69,29.24 33.69,17.43 35.82,15.29 J7.1
DM  (via drill 0.35)
  Top 0.152: v31.33,63.38 32.55,63.38 J6.D- | v30.11,64.44 30.11,63.99 28.13,62.01 28.13,49.59 v27.21,48.67 | v29.04,40.75 28.43,40.14 27.75,40.14 IC2.16
  Bottom 0.152: v31.33,63.38 31.18,63.38 v30.11,64.44 | v27.21,48.67 27.21,41.58 28.05,40.75 v29.04,40.75
DP
  Top 0.152: J6.D+ 32.55,63.99 31.02,63.99 30.72,63.68 30.72,49.43 30.79,49.36 30.79,41.58 28.74,39.53 27.75,39.53 IC2.15
DRAIN  (via drill 0.35)
  Top 0.61: v32.55,56.44 31.71,55.61 31.71,40.97 Q3.3
  Bottom 0.61: 31.25,57.59 C5.2 | C11.2 30.18,61.09 30.18,58.81 31.1,57.89 C5.2 | 31.86,54.69 D2.A 32.01,54.46 | 32.01,54.46 35.29,54.46 TO_MOTOR.2 | C5.2 32.01,56.79 | 32.01,56.79 32.01,54.46 | 32.01,56.79 32.36,56.44 v32.55,56.44
DTR  (via drill 0.35)
  Top 0.152: v19.44,49.05 19.44,47.6 19.75,47.3 20.43,47.3 IC2.2
  Bottom 0.152: v19.44,49.05 19.44,55.99 20.05,56.59 C8.2
GATE  (via drill 0.35)
  Top 0.152: v29.73,38.84 30.64,38.84 Q3.1 | v29.88,48.59 28.81,49.66 28.81,52.78 OK1.7
  Bottom 0.152: v29.73,38.84 29.73,41.13 28.43,42.42 R4.2 28.43,42.5 29.88,43.95 v29.88,48.59
GND  (via drill 0.35)
  Top 0.152: U2.5 7.63,49.13 7.1,49.13 6.72,49.51 6.72,50.19 7.17,50.65 U2.3 7.1,50.65 5.27,52.48 5.27,56.75 C6.1 | 4.2,57.97 4.2,57.81 5.19,56.82 C6.1 | 4.2,57.97 4.2,60.56 5.27,61.62 5.27,62.39 RX.C | 3.25,41.24 3.21,41.2 1.46,41.2 1.23,41.43 1.23,57.66 1.53,57.97 4.2,57.97 | 3.25,41.24 4.35,42.35 5.12,42.35 C7.1 | v6.56,56.75 5.34,56.75 C6.1 | v3.29,19.64 3.29,41.2 3.25,41.24 | J2.1 35.06,32.29 32.55,34.8 31.71,34.8 U1.14 31.63,34.88 v26.07,34.88 | v20.74,30.84 16.7,30.84 U1.3 | IC2.25 27.75,46 27.75,46.54 IC2.26 | 28.47,43.3 28.43,43.34 27.75,43.34 IC2.21 | 28.47,43.3 28.74,43.03 28.74,41.74 28.43,41.43 27.75,41.43 IC2.18 27.67,41.43 23.71,41.43 21.19,43.95 20.51,43.95 IC2.7 20.43,44.02 19.82,44.02 v19.14,44.71 | 28.47,43.3 28.74,43.56 28.74,45.62 28.36,46 27.82,46 IC2.25 | v19.14,45.93 19.14,47.76 17.08,49.81 16.24,49.81 U2.21 | 13.61,67.61 13.19,68.03 S5.4 13.12,68.1 7.86,68.1 | 13.61,67.61 13.65,67.57 13.65,64.29 12.81,63.45 12.81,62.46 TX.C | 7.86,68.1 7.63,68.1 S5.3 7.86,68.1 | 32.89,65.62 35.22,67.95 J6.MT2 | 32.89,65.62 32.62,65.36 J6.GND 32.55,65.28 31.86,65.28 31.82,65.24 | 32.89,65.62 33.61,64.9 33.61,62.08 35.22,60.48 35.22,60.02 J6.MT1 35.22,59.95 34.15,58.88 34.15,53.93 35.22,52.86 35.22,51.11 LIPO7.4.2 | 31.82,65.24 28.81,62.23 28.81,59.03 OK1.2 28.81,58.96 29.42,58.35 29.42,50.27 30.49,49.2 30.49,48.29 28.43,46.23 28.43,46 IC2.25 | 31.82,65.24 29.2,67.87 29.2,69.24 27.52,70.92 25.16,70.92 22.79,68.56 16.24,68.56 15.33,67.64 13.65,67.64 13.61,67.61 | 7.86,68.1 v7.86,67.11
  Bottom 0.152: v6.56,56.75 7.93,56.75 C10.2 8.01,56.82 8.01,59.57 C1.2 8.01,59.64 8.01,64.29 7.86,64.44 v7.86,67.11 | v3.29,19.64 6.41,16.51 6.41,2.72 JP2.1 | C9.2 6.72,27.64 6.72,24.74 6.87,24.59 D3.A 6.87,24.51 9.61,24.51 C2.2 9.69,24.51 10.37,24.51 16.7,30.84 v20.74,30.84 22.03,30.84 | 22.03,34.88 22.03,35.79 21.5,36.33 CR1.3 22.03,34.88 | 22.03,34.88 22.03,30.84 | 22.03,30.84 22.03,30.76 IC1.1 22.03,30.84 | 22.03,34.88 v26.07,34.88 26.07,35.41 28.66,38 28.66,39.14 23.1,44.71 v19.14,44.71 v19.14,45.93
INT0
  Top 0.152: U2.32 9.15,53.7 9.15,51.64 9.76,51.03 9.76,48.06 8.54,46.84 8.54,46.31 6.18,43.95 6.18,41.28 4.12,39.22 4.12,25.35 4.73,24.74 9.69,24.74 12.43,22 28.36,22 31.18,24.82 31.63,24.82 U1.9
MGND  (via drill 0.35)
  Top 0.61: v31.79,39.6 32.55,38.84 Q3.2
  Bottom 0.61: C4.2 31.4,51.57 31.4,50.88 32.62,49.66 32.62,47.38 31.25,46 R1.1 31.18,45.62 31.18,42.73 R4.1 31.25,42.42 31.79,41.89 v31.79,39.6 31.94,39.37 31.94,34.65 33.69,32.9 33.69,30.76 34.2,30.25 35.4,30.25 35.85,29.8 LIPO11.1.2 | D1.A 9.31,68.1 9.31,65.74 9,65.43 C3.2 9.08,65.13 9.08,61.02 9.38,60.71 9.38,55.76 5.19,51.57 5.19,42.57 2.6,39.98 2.6,23.75 5.04,21.32 28.74,21.32 35.82,28.4 LIPO11.1.2 | 35.75,28.71 LIPO11.1.2
MISO  (via drill 0.35)
  Top 0.152: v7.93,23.14 9.15,23.14 Q1.3 | v6.94,22.15 5.73,20.93 R16.1 | v15.78,38.38 14.79,39.37 14.79,45.17 U2.16 | v32.78,36.33 17.77,36.33 v16.93,37.16
  Bottom 0.152: v6.94,22.15 7.36,22.57 | 7.36,22.57 v7.93,23.14 | 7.36,22.57 5.57,24.36 5.57,28.63 5.73,28.78 6.18,28.78 v15.78,38.38 15.78,38.31 v16.93,37.16 | v32.78,36.33 33,36.1 35.6,36.1 36.36,36.86 36.36,37.77 35.6,38.54 35.29,38.54 34.45,39.37 34.45,40.36 35.06,40.97 35.06,42.35 J2.5
MOSI
  Top 0.152: 13.84,37.81 13.88,37.85 13.88,39.75 | 13.84,37.81 13.65,37.62 11.67,37.62 11.21,38.08 9.23,38.08 Q4.3 | 13.88,39.75 13.88,45.17 U2.15 | 13.88,39.75 9.15,39.75 5.73,36.33 5.73,35.94 R17.1 | J2.4 35.6,39.83 34.83,39.83 31.86,36.86 18.15,36.86 17.23,37.77 13.88,37.77 13.84,37.81
MOTORSIG  (via drill 0.35)
  Top 0.152: v15.33,55.07 15.33,51.87 15.71,51.49 16.17,51.49 U2.23
  Bottom 0.152: v15.33,55.07 17,56.75 R3.1
N$1
  Top 0.152: IC2.20 27.67,42.73 24.32,42.73 21.12,45.93 20.51,45.93 IC2.4
N$4
  Top 0.152: U2.7 7.63,47.53 7.1,47.53 3.9,50.73 3.9,52.02 Y1.2 3.82,52.1 2.45,53.47 2.45,56.75 C6.2
N$5
  Top 0.152: U2.8 7.63,46.69 4.2,46.69 3.9,46.99 Y1.1 4.12,46.69 2.37,44.94 2.37,42.42 C7.2
N$6
  Bottom 0.61: F1.1 12.74,65.21 16.17,65.21 16.62,64.75 S3.1
N$7
  Top 0.152: TX.A 9.84,62.39 9.84,59.64 R20.1
N$8
  Top 0.152: RX.A 2.3,62.39 2.3,59.8 2.45,59.64 R12.1
N$9
  Top 0.61: IC3.3 17.69,58.88 14.34,58.88 10.91,62.31 10.91,64.14 9.84,65.21 2.6,65.21 F1.2
  Bottom 0.61: D1.C 6.11,68.1 6.11,65.43 C3.1 5.88,65.21 2.6,65.21 F1.2
N$10  (via drill 0.35)
  Top 0.61: v22.41,54.84 22.41,58.81 IC3.1
  Bottom 0.61: R1.2 28.43,45.7 28.43,48.44 28.51,48.52 R2.1 28.43,48.82 v22.41,54.84
N$11  (via drill 0.35)
  Top 0.61: v9.92,63.91 9.31,63.91 v6.41,61.02
  Bottom 0.61: v9.92,63.91 10.22,64.22 10.22,65.05 12.36,67.19 16.62,67.19 S3.2 | v6.41,61.02 6.41,57.81 1.84,53.24 1.84,23.37 4.66,20.55 30.49,20.55 35.82,25.89 LIPO11.1.1
N$12  (via drill 0.35)
  Top 0.152: v30.11,62.62 30.11,59.03 OK1.1
  Bottom 0.152: v30.11,62.62 28.51,64.22 28.51,67.42 27.52,68.41 26.68,68.41 23.79,71.3 21.35,71.3 18.3,68.25 18.3,64.67 17.08,63.45 17.08,59.57 R3.2
N$13
  Bottom 0.61: S4.3 27.06,69.7 35.29,61.47 35.29,56.98 TO_MOTOR.1
N$19
  Bottom 0.152: S2.2 21.96,67.19 21.96,66.35 26.3,62.01 26.3,57.66 27.82,56.14 28.74,56.14 30.64,54.23 30.64,53.39 31.33,52.71 32.32,52.71 34.07,50.96 34.07,49.74 35.22,48.59 LIPO7.4.1
N$20
  Bottom 0.152: F2.1 7.93,42.04 7.93,43.49 18.91,54.46 18.91,66.73 21.88,69.7 S2.1
N$21
  Bottom 0.152: D3.C 3.67,24.51 3.67,27.49 3.82,27.64 C9.1 3.9,27.71 3.9,30.08 15.78,41.97 17.99,41.97 F2.2 18.07,41.97 23.4,41.97 26.76,38.61 27.52,38.61 CR1.1
RADIO_RX  (via drill 0.35)
  Top 0.152: v17.46,50.35 17.46,51.49 16.7,52.25 16.24,52.25 U2.24 | v17.08,43.49 17.08,41.05 20.66,37.47 v29.73,37.47 | v34.3,28.1 34.3,23.6 35.75,22.15 J4.1
  Bottom 0.152: v17.46,50.35 17.46,43.87 v17.08,43.49 | v29.73,37.47 29.73,36.1 33.16,32.67 33.16,29.24 v34.3,28.1 | JP2.9 26.76,2.65 25.69,2.65 24.7,1.65 23.79,1.65 23.18,2.27 23.18,7.75 35.75,20.32 35.75,22.08 J4.1
RADIO_TX  (via drill 0.35)
  Top 0.152: v14.72,51.19 14.72,53.7 U2.25 | v3.9,40.06 3.9,39.45 3.82,39.37 3.82,20.71 5.57,18.95 6.87,18.95 8.01,17.81 8.01,17.5 21.8,3.71 23.18,3.71 24.17,2.72 JP2.8
  Bottom 0.152: v14.72,51.19 14.72,50.88 v3.9,40.06 | J5.1 35.9,18.5 35.9,16.97 24.24,5.31 24.24,2.72 JP2.8
RESET  (via drill 0.35)
  Top 0.152: S5.1 7.63,71.91 13.12,71.91 S5.2 13.19,71.84 17.46,71.84 v20.13,69.17 | v12.58,55.3 11.59,54.31 11.59,53.78 U2.29 | v33.16,60.48 v33.16,50.96 | v29.12,64.52 29.12,66.81 27.37,68.56 v23.71,68.56
  Bottom 0.152: v12.58,55.3 14.49,55.3 14.95,55.76 14.95,58.35 14.91,58.39 | 14.91,58.39 13.88,59.42 R21.1 | 23.06,69.21 23.1,69.24 23.1,70.31 22.41,71 21.5,71 19.9,69.4 | 23.06,69.21 22.41,68.56 21.57,68.56 20.13,67.11 20.13,59.49 C8.1 | 19.9,69.4 18.6,68.1 18.6,59.11 17.92,58.42 14.95,58.42 14.91,58.39 | 19.9,69.4 v20.13,69.17 | v33.16,50.96 33.16,40.21 35.06,38.31 35.06,37.39 J2.3 | v29.12,64.52 v33.16,60.48 | 23.06,69.21 v23.71,68.56
RX
  Top 0.152: 11.06,55.91 10.75,55.61 10.75,53.78 U2.30 | 11.06,55.91 11.06,57.66 10.22,58.5 6.41,58.5 5.34,59.57 R12.2 | 11.06,55.91 15.4,55.91 17.15,54.16 17.15,52.25 20.43,48.98 20.43,47.91 IC2.1
SCK  (via drill 0.35)
  Top 0.152: v8.85,32.36 9.08,32.59 9.08,33.35 Q5.3 | v6.87,32.14 5.65,30.92 R19.1 | 19.44,40.21 19.44,39.14 19.59,38.99 28.97,38.99 30.18,40.21 32.17,40.21 33.92,41.97 33.92,43.26 35.6,44.94 J2.6 | 19.44,40.21 19.44,42.57 18.37,43.64 18.07,43.64 16.24,45.47 16.24,46.61 U2.17 | 19.44,40.21 v19.14,40.21
  Bottom 0.152: v6.87,32.14 7.1,32.36 v8.85,32.36 16.7,40.21 v19.14,40.21
SS  (via drill 0.35)
  Top 0.152: 8.05,28.29 5.73,25.96 R22.1 | 8.05,28.29 8.09,28.32 9.31,28.32 Q2.3 | v13.12,40.36 13.12,45.17 U2.14 | v7.55,34.8 7.55,28.78 8.05,28.29
  Bottom 0.152: v7.55,34.8 v13.12,40.36
TX  (via drill 0.35)
  Top 0.152: R20.2 9.92,56.75 9.92,53.78 U2.31 9.99,53.7 9.99,53.24 14.03,49.2 v14.03,48.59 | v16.85,45.78 17.31,45.32 20.43,45.32 IC2.5
  Bottom 0.152: v14.03,48.59 v16.85,45.78
VCC  (via drill 0.35)
  Top 0.152: U2.6 7.71,48.29 8.16,48.29 8.54,48.67 8.54,49.43 8.16,49.81 7.71,49.81 U2.4 8.24,49.81 v9.15,50.73 | 10.11,47.41 6.49,43.79 6.49,39.45 5.73,38.69 R17.2 5.65,38.61 4.51,37.47 4.51,34.95 5.57,33.89 5.57,33.73 R19.2 5.57,33.66 4.43,32.52 4.43,30 5.65,28.78 R22.2 | 10.11,47.41 10.14,47.45 16.17,47.45 U2.18 16.24,47.45 v18.53,47.45 | v10.07,47.45 10.11,47.41 | v29.2,35.72 34.68,35.72 35.6,34.8 J2.2 | 30.91,18.91 31.86,17.96 JP1.11 | 30.91,18.91 30.87,18.95 9.15,18.95 7.55,20.55 7.55,22.46 6.34,23.68 5.73,23.68 R16.2 | v29.65,27.71 29.65,26.42 30.34,25.73 33.23,25.73 33.39,25.58 33.39,21.39 30.91,18.91
  Bottom 0.152: C10.1 10.83,56.82 10.83,59.57 C1.1 | 11.06,56.67 13.8,56.67 R21.2 | 11.06,56.67 10.91,56.82 C10.1 | 11.06,56.67 9.15,54.77 v9.15,50.73 9.15,48.37 v10.07,47.45 | 11.06,56.67 C10.1 | v29.65,27.71 26.68,30.69 IC1.3 26.68,30.76 27.52,31.6 27.52,34.04 CR1.2 27.6,34.12 v29.2,35.72 29.12,35.72 29.12,39.14 20.81,47.45 v18.53,47.45
(copper drawn outside any net)
  shapes: Top area x5

### Text on the board
tNames: MOSI | GND | DRAIN | Q1 | GND | MGND | lin controls rev1 | RADIO_RX | SCK | MOSO | RADIO_TX | VCC | ANT | GND | GND | RADIO_TX | RADIO_RX